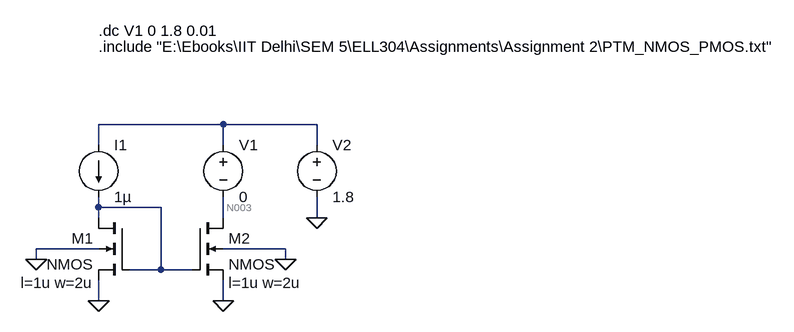
[diagram p0: schematic Q1p1.asc]
Q1p1.asc, the LTspice schematic file:
Version 4
SHEET 1 1236 680
WIRE 288 -32 96 -32
WIRE 432 -32 288 -32
WIRE 96 0 96 -32
WIRE 288 0 288 -32
WIRE 432 0 432 -32
WIRE 96 96 96 80
WIRE 192 96 96 96
WIRE 96 112 96 96
WIRE 288 112 288 80
WIRE 432 112 432 80
WIRE 96 160 0 160
WIRE 384 160 288 160
WIRE 0 176 0 160
WIRE 384 176 384 160
WIRE 192 192 192 96
WIRE 192 192 144 192
WIRE 240 192 192 192
WIRE 96 240 96 208
WIRE 288 240 288 208
FLAG 96 240 0
FLAG 288 240 0
FLAG 432 112 0
FLAG 0 176 0
FLAG 384 176 0
SYMBOL current 96 0 R0
WINDOW 123 0 0 Left 0
WINDOW 39 0 0 Left 0
SYMATTR InstName I1
SYMATTR Value 1µ
SYMBOL voltage 288 -16 R0
WINDOW 123 0 0 Left 0
WINDOW 39 0 0 Left 0
SYMATTR InstName V1
SYMATTR Value 0
SYMBOL voltage 432 -16 R0
WINDOW 123 0 0 Left 0
WINDOW 39 0 0 Left 0
SYMATTR InstName V2
SYMATTR Value 1.8
SYMBOL nmos4 144 112 M0
WINDOW 123 56 100 Left 2
SYMATTR Value2 l=1u w=2u
SYMATTR InstName M1
SYMBOL nmos4 240 112 R0
WINDOW 123 56 100 Left 2
SYMATTR Value2 l=1u w=2u
SYMATTR InstName M2
TEXT 96 -176 Left 2 !.dc V1 0 1.8 0.01
TEXT 96 -152 Left 2 !.include "E:\\Ebooks\\IIT Delhi\\SEM 5\\ELL304\\Assignments\\Assignment 2\\PTM_NMOS_PMOS.txt"

The netlist it stands for:
* Q1p1.asc
I1 N001 N002 1µ
V1 N001 N003 0
V2 N001 0 1.8
M1 N002 N002 0 0 NMOS l=1u w=2u
M2 N003 N002 0 0 NMOS l=1u w=2u
.model NMOS NMOS
.model PMOS PMOS
.lib standard.mos
.dc V1 0 1.8 0.01
.include "E:\Ebooks\IIT Delhi\SEM 5\ELL304\Assignments\Assignment 2\PTM_NMOS_PMOS.txt"
.backanno
.end

* Results of the author's LTspice run, read from the files saved beside the schematic
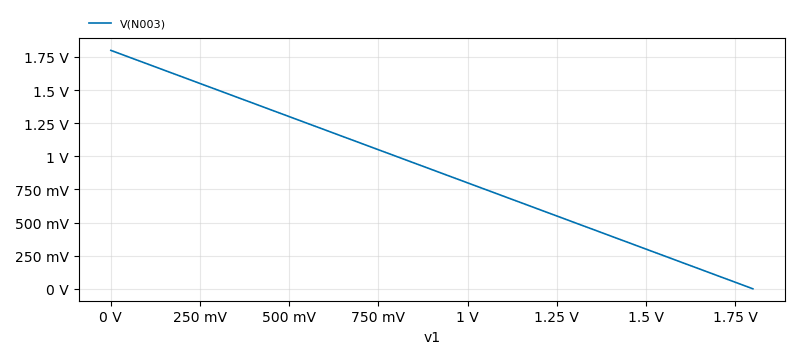
[diagram p1: DC transfer characteristic of Q1p1.asc, plotted from the saved traces]
* DC transfer characteristic, 1 run:
*   V(N003): 1.8 V at v1=0 V, 0 V at v1=1.8 V, min 0 V, max 1.8 V